# EAGLE design matrix (EAGLE 7.1.0)
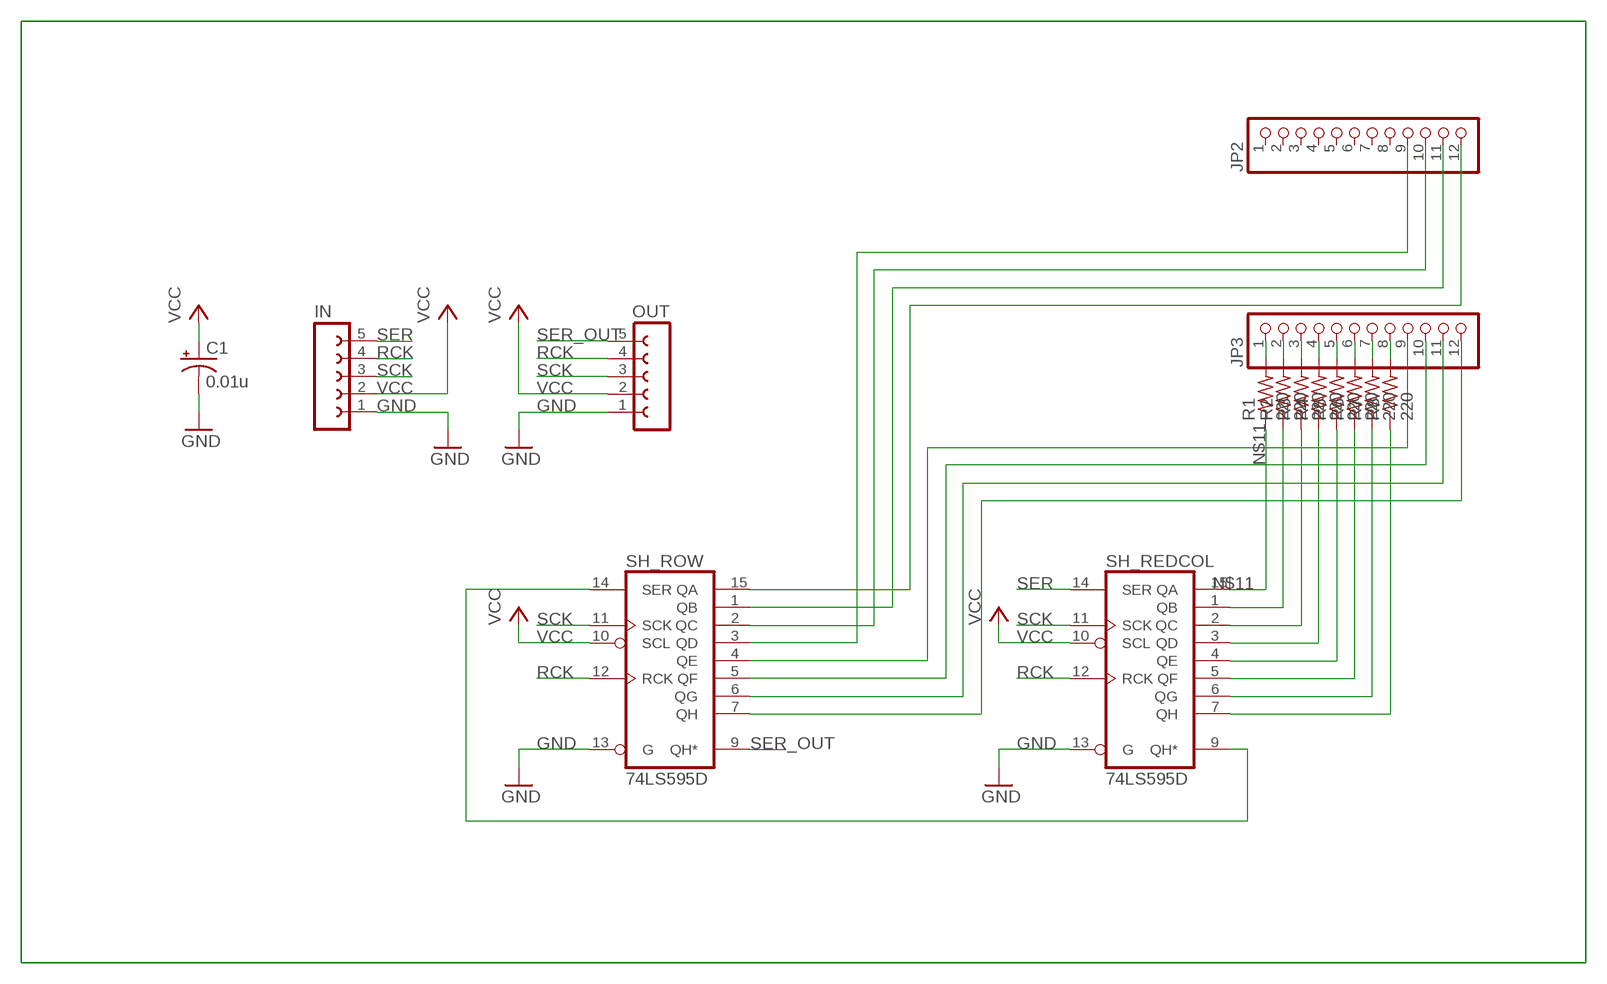
[diagram p0: schematic, sheet 1]

## Parts
C1  0.01u  CPOL-USE2.5-5  [E2,5-5]
IN  FE05W  [FE05W]
JP2  PINHD-1X12-CB  [1X12-CB]
JP3  PINHD-1X12-CB  [1X12-CB]
OUT  FE05W  [FE05W]
R1  220  R-US_R0603  [R0603]
R2  220  R-US_R0603  [R0603]
R3  220  R-US_R0603  [R0603]
R4  220  R-US_R0603  [R0603]
R5  220  R-US_R0603  [R0603]
R6  220  R-US_R0603  [R0603]
R7  220  R-US_R0603  [R0603]
R8  220  R-US_R0603  [R0603]
SH_REDCOL  74LS595D  [SO16]
SH_ROW  74LS595D  [SO16]

## Nets
GND: C1.- IN.1 OUT.1 SH_REDCOL.13(G) SH_ROW.13(G)
N$1: JP3.1 R1.2
N$4: R4.1 SH_REDCOL.3(QD)
N$5: R5.1 SH_REDCOL.4(QE)
N$6: JP2.12 SH_ROW.15(QA)
N$7: JP2.11 SH_ROW.1(QB)
N$8: JP2.10 SH_ROW.2(QC)
N$9: JP2.9 SH_ROW.3(QD)
N$10: JP3.9 SH_ROW.4(QE)
N$11: R1.1 SH_REDCOL.15(QA)
N$12: R2.1 SH_REDCOL.1(QB)
N$13: R3.1 SH_REDCOL.2(QC)
N$14: R6.1 SH_REDCOL.5(QF)
N$15: R7.1 SH_REDCOL.6(QG)
N$16: R8.1 SH_REDCOL.7(QH)
N$17: JP3.10 SH_ROW.5(QF)
N$18: JP3.11 SH_ROW.6(QG)
N$19: JP3.12 SH_ROW.7(QH)
N$22: JP3.2 R2.2
N$23: JP3.3 R3.2
N$24: JP3.4 R4.2
N$25: JP3.5 R5.2
N$26: JP3.6 R6.2
N$27: JP3.7 R7.2
N$28: JP3.8 R8.2
RCK: IN.4 OUT.4 SH_REDCOL.12(RCK) SH_ROW.12(RCK)
SCK: IN.3 OUT.3 SH_REDCOL.11(SCK) SH_ROW.11(SCK)
SER: IN.5 SH_REDCOL.14(SER)
SER2: SH_REDCOL.9(QH*) SH_ROW.14(SER)
SER_OUT: OUT.5 SH_ROW.9(QH*)
VCC: C1.+ IN.2 OUT.2 SH_REDCOL.10(SCL) SH_ROW.10(SCL)
Unconnected: JP2.1 JP2.2 JP2.3 JP2.4 JP2.5 JP2.6 JP2.7 JP2.8

## Power pins joined to a net without a drawn wire
GND: SH_REDCOL.8(GND) SH_ROW.8(GND)
VCC: SH_REDCOL.16(VCC) SH_ROW.16(VCC)

## Library data of the parts
C1 = adafruit:CPOL-US: POLARIZED CAPACITOR, American symbol
IN OUT = con-lsta:FE05W: FEMALE HEADER; OC_FARNELL: unknown; OC_NEWARK: unknown
JP2 JP3 = adafruit:PINHD-1X12: PIN HEADER
R1-R8 = adafruit:R-US_: RESISTOR, American symbol
SH_REDCOL SH_ROW = 74xx-us:74*595: 8-bit SHIFT REGISTER, output latch

## Net classes
0 default: width 0.33 mm

## Board
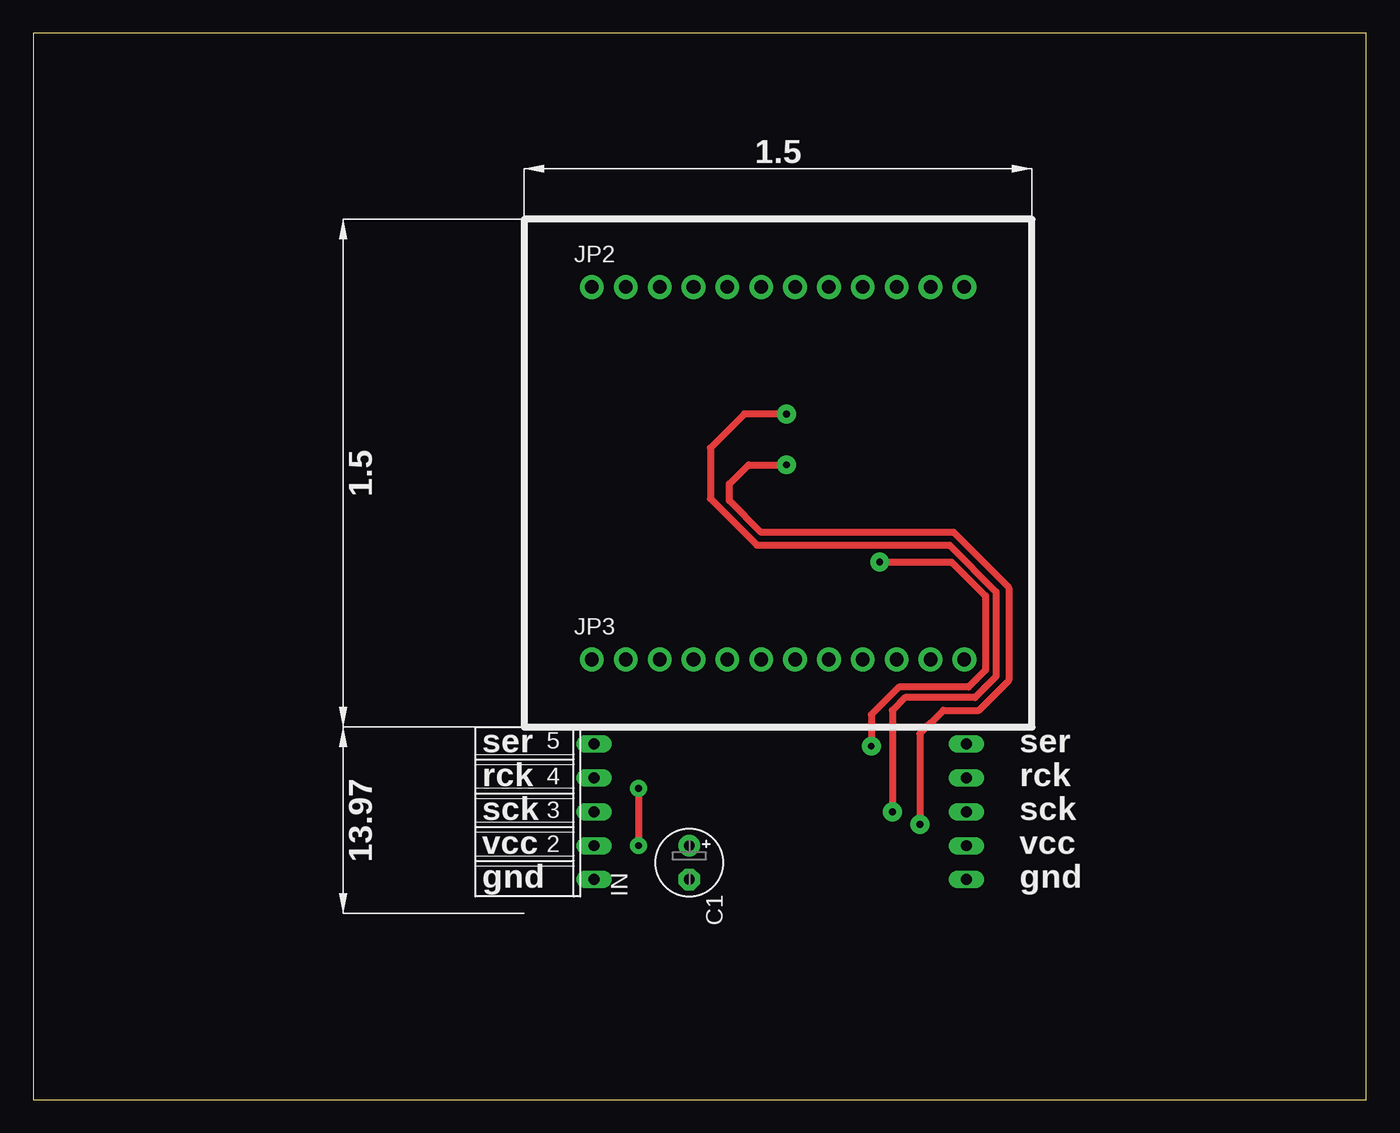
[diagram p1: board, top side]
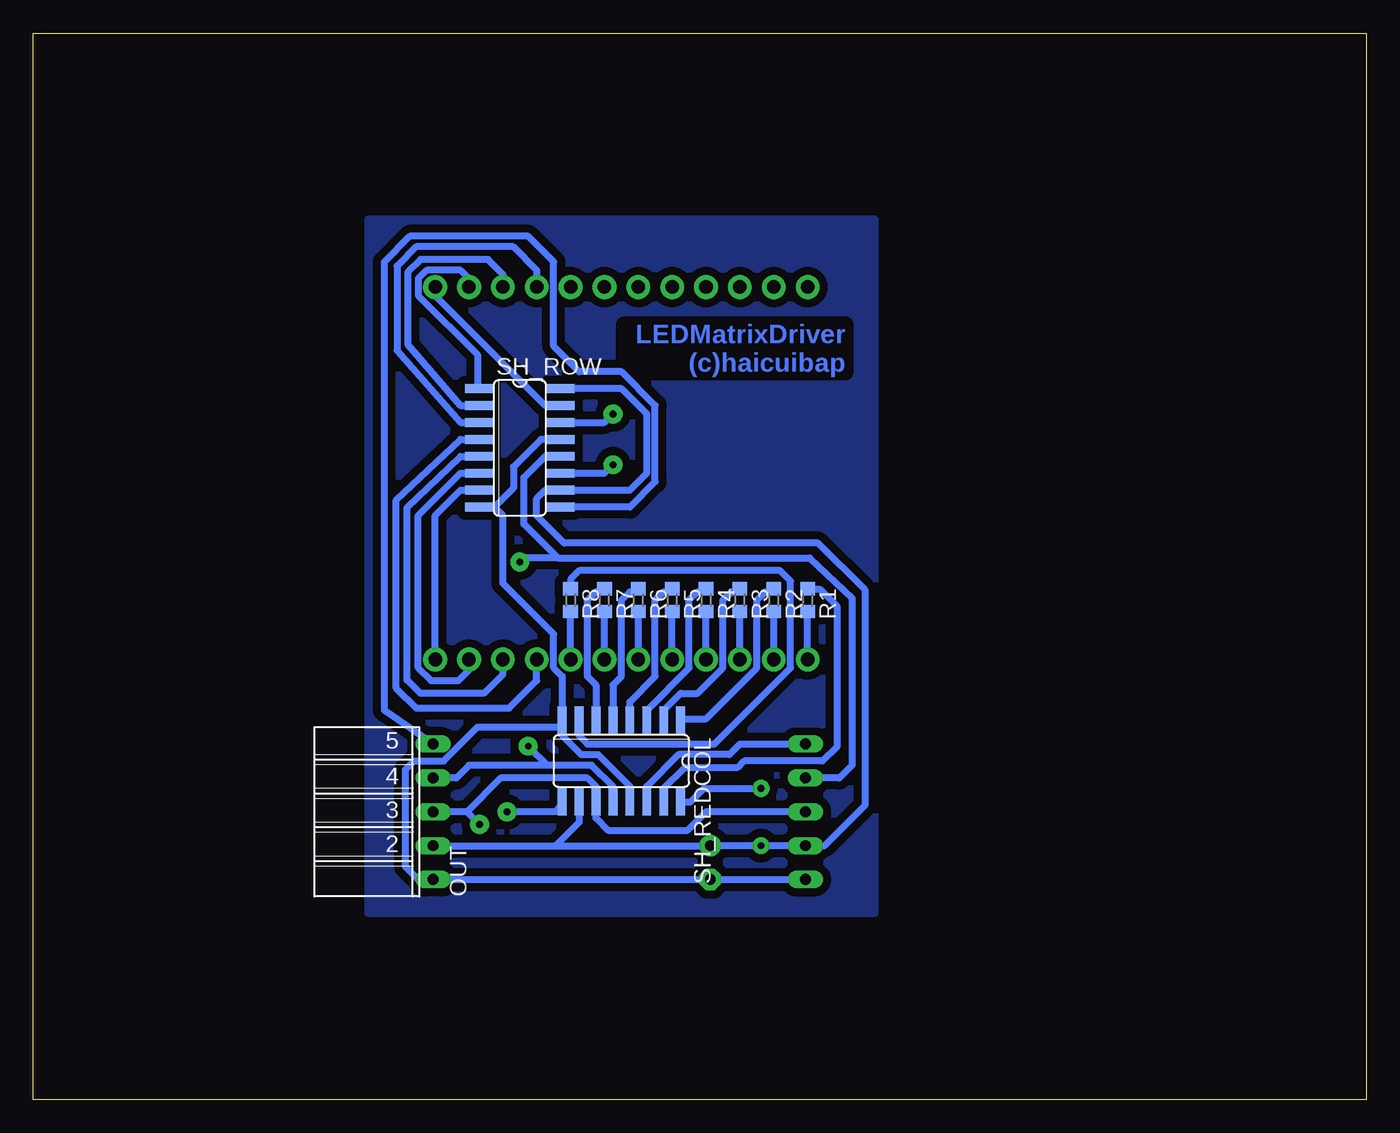
[diagram p2: board, bottom side, seen from below]

Size 100 x 80 mm. Coordinates in mm from the lower left corner, seen from the top.
Outline: 0,0 100,0 100,80 0,80 0,0
Copper layers (1*16): Top 0.035mm / dielectric 1.5mm / Bottom 0.035mm
Design rules "default": minimum track width 10mil, minimum drill 0.6mm, track to track 8mil, track to pad 8mil, pad to pad 8mil, via to via 8mil, smd to smd 8mil, copper to edge 40mil, drill to drill 8mil, minimum pad ring 10mil, minimum via ring 8mil, stop-mask expansion 4mil, vias tented up to drill 0mil, thermal gap 10mil

### Footprints (pad centres in the part's own frame; a part is rotated, then mirrored left to right if it is on the bottom)
E2,5-5 = drill 0.813 pad 1.6: + -1.27,0 | drill 0.813 pad 1.6 octagon: - 1.27,0
FE05W = drill 0.813 long: 1 -5.08,0; 2 -2.54,0; 3 0,0; 4 2.54,0; 5 5.08,0
1X12-CB = drill 1.016 pad 1.778: 1 -13.97,0; 2 -11.43,0; 3 -8.89,0; 4 -6.35,0; 5 -3.81,0; 6 -1.27,0; 7 1.27,0; 8 3.81,0; 9 6.35,0; 10 8.89,0; 11 11.43,0; 12 13.97,0
R0603 = smd 1 x 1.1: 1 -0.85,0; 2 0.85,0
SO16 = smd 0.66 x 2.032: 1 -4.445,-3.073; 2 -3.175,-3.073; 3 -1.905,-3.073; 4 -0.635,-3.073; 5 0.635,-3.073; 6 1.905,-3.073; 7 3.175,-3.073; 8 4.445,-3.073; 9 4.445,3.073; 10 3.175,3.073; 11 1.905,3.073; 12 0.635,3.073; 13 -0.635,3.073; 14 -1.905,3.073; 15 -3.175,3.073; 16 -4.445,3.073

### Placement (x,y rotation side)
C1  49.21,17.78 270 top
IN  42.07,21.59 90 top
JP2  55.88,60.96 0 top
JP3  55.88,33.02 0 top
OUT  70.01,21.59 90 bottom
R1  41.91,37.47 270 bottom
R2  44.45,37.47 270 bottom
R3  46.99,37.47 270 bottom
R4  49.53,37.47 270 bottom
R5  52.07,37.47 270 bottom
R6  54.61,37.47 270 bottom
R7  57.15,37.47 270 bottom
R8  59.69,37.47 270 bottom
SH_REDCOL  55.88,25.4 180 bottom
SH_ROW  63.5,48.9 270 bottom

### Tracks (layer width: path | path; a pad name or v marks a point on that pad's centre or on a via)
GND
  Bottom 0.508: IN.1 C1.- OUT.1 71.12,16.51 72.07,17.46 72.07,24.77 71.44,25.4 69.22,25.4 66.67,27.94 60.33,27.94 | SH_REDCOL.13 55.24,23.5 57.63,25.88 58.9,25.88 60.33,27.3 60.33,27.94 | 60.33,27.94 SH_REDCOL.8 60.33,31.75 60.96,32.38 60.96,34.92 64.77,38.73 64.77,43.81 65.41,44.45 | 65.41,44.45 SH_ROW.8 | SH_ROW.13 61.91,49.53 63.98,47.47 63.98,45.88 65.41,44.45
N$1
  Bottom 0.508: JP3.1 R1.2
N$4
  Bottom 0.508: SH_REDCOL.3 53.98,29.21 50.8,32.38 50.8,37.47 50.16,38.1 49.53,38.1 R4.1
N$5
  Bottom 0.508: SH_REDCOL.4 55.24,29.84 53.34,31.75 53.34,37.47 52.7,38.1 52.07,38.1 R5.1
N$6
  Bottom 0.508: SH_ROW.15 61.59,52.07 69.85,60.33 JP2.12
N$7
  Bottom 0.508: SH_ROW.1 66.67,53.34 66.67,55.88 71.12,60.33 71.12,61.59 70.48,62.23 67.94,62.23 67.31,61.59 JP2.11
N$8
  Bottom 0.508: SH_ROW.2 67.94,52.07 71.91,56.67 71.91,62.07 70.96,63.02 65.88,63.02 64.77,61.91 JP2.10
N$9
  Bottom 0.508: SH_ROW.3 67.94,50.8 72.71,56.2 72.71,62.55 71.28,63.98 63.98,63.98 62.23,62.23 JP2.9
N$10
  Bottom 0.508: SH_ROW.4 67.94,49.53 72.76,44.97 72.76,30.85 71.28,29.37 64.29,29.37 62.23,31.43 JP3.9
N$11
  Bottom 0.508: R1.1 41.85,38.26 40.96,38.26 39.69,36.99 39.69,26.51 40.8,25.4 46.67,25.4 47.15,24.92 51.12,24.92 52.7,23.34 SH_REDCOL.15
N$12
  Bottom 0.508: R2.1 44.45,38.1 45.09,38.1 45.72,37.47 45.72,32.38 49.53,28.57 51.44,28.57 SH_REDCOL.1
N$13
  Bottom 0.508: SH_REDCOL.2 52.7,29.21 51.44,30.48 50.16,30.48 48.26,32.38 48.26,37.47 47.62,38.1 46.99,38.1 R3.1
N$14
  Bottom 0.508: R6.1 54.61,38.1 55.24,38.1 55.88,37.47 55.88,31.75 56.52,31.11 SH_REDCOL.5
N$15
  Bottom 0.508: R7.1 57.15,38.1 57.78,38.1 58.42,37.47 58.42,31.75 57.78,31.11 SH_REDCOL.6
N$16
  Bottom 0.508: SH_REDCOL.7 59.05,27.3 58.42,26.67 48.9,26.67 43.18,32.38 43.18,38.89 43.97,39.69 59.05,39.69 59.69,39.05 R8.1
N$17
  Bottom 0.508: SH_ROW.5 67.94,48.26 71.94,44.43 71.96,43.77 71.96,31.48 70.96,30.48 66.2,30.48 64.77,31.91 JP3.10
N$18
  Bottom 0.508: SH_ROW.6 67.94,46.99 71.12,43.81 71.12,32.38 70.17,31.43 68.1,31.43 67.31,32.23 JP3.11
N$19
  Bottom 0.508: SH_ROW.7 67.94,45.72 69.85,43.81 JP3.12
N$22
  Bottom 0.508: JP3.2 R2.2
N$23
  Bottom 0.508: JP3.3 R3.2
N$24
  Bottom 0.508: JP3.4 R4.2
N$25
  Bottom 0.508: JP3.5 R5.2
N$26
  Bottom 0.508: JP3.6 R6.2
N$27
  Bottom 0.508: JP3.7 R7.2
N$28
  Bottom 0.508: JP3.8 R8.2
N$36
  pour Bottom (isolate 0.61): 74.93,13.97 36.83,13.97 36.83,66.04 74.93,66.04
RCK  (via drill 0.51 pad 1.42)
  Top 0.508: v63.5,40.32 68.9,40.32 71.44,37.78 71.44,32.23 70.17,30.96 64.93,30.96 62.87,28.89 v62.87,26.51
  Bottom 0.508: SH_ROW.12 61.59,48.26 63.18,46.67 63.18,43.18 60.64,40.64 | SH_REDCOL.12 56.52,23.5 58.1,25.08 61.44,25.08 | 60.64,40.64 41.75,40.64 38.58,37.62 38.58,25.08 39.53,24.13 IN.4 | OUT.4 68.26,24.13 67.31,25.08 61.44,25.08 | v62.87,26.51 61.44,25.08 | 60.64,40.64 63.18,40.64 v63.5,40.32
SCK  (via drill 0.51 pad 1.42)
  Top 0.508: v56.52,47.62 53.66,47.62 52.23,46.2 52.23,44.93 54.61,42.55 69.06,42.55 73.18,38.42 73.18,31.43 70.96,29.21 68.26,29.21 66.52,27.46 v66.52,20.64
  Bottom 0.254: 57.78,21.75 SH_REDCOL.11
  Bottom 0.508: SH_REDCOL.11 57.78,23.5 58.42,24.13 64.93,24.13 67.47,21.59 | SH_ROW.11 57.15,46.99 v56.52,47.62 | 69.85,21.59 OUT.3 67.47,21.59 | v66.52,20.64 67.47,21.59 | IN.3 49.53,21.59 50.96,20.16 56.83,20.16 57.78,21.11 57.78,21.75
SER
  Bottom 0.508: IN.5 46.99,26.67 47.78,25.88 51.59,25.88 53.98,23.5 SH_REDCOL.14
SER2  (via drill 0.51 pad 1.42)
  Top 0.508: v56.52,51.44 53.34,51.44 50.8,48.9 50.8,45.09 54.29,41.59 68.74,41.59 72.23,38.1 72.23,31.75 70.64,30.16 65.41,30.16 64.45,29.21 v64.45,21.59
  Bottom 0.508: SH_REDCOL.9 60.33,22.23 60.8,21.59 v64.45,21.59 | SH_ROW.14 57.15,50.8 v56.52,51.44
SER_OUT
  Bottom 0.508: OUT.5 73.66,29.21 73.66,62.87 71.75,64.77 62.87,64.77 60.96,62.87 60.96,56.52 59.05,54.61 55.88,54.61 53.34,52.07 53.34,46.35 55.24,44.45 SH_ROW.9
VCC  (via drill 0.51 pad 1.27)
  Top 0.508: v45.4,23.34 v45.4,19.05
  Bottom 0.508: OUT.2 60.8,19.05 | 59.05,22.23 SH_REDCOL.10 59.05,20.8 60.8,19.05 | SH_ROW.16 55.88,53.34 53.98,51.44 53.98,46.99 55.24,45.72 SH_ROW.10 61.59,45.72 62.23,45.09 62.23,43.81 60.17,41.75 41.12,41.75 37.62,38.26 37.62,22.07 40.64,19.05 IN.2 v45.4,19.05 C1.+ 60.8,19.05 | SH_REDCOL.16 50.7,22.33 49.69,23.34 v45.4,23.34

### Text on the board
Bottom: LEDMatrixDriver / (c)haicuibap
tNames: ser | ser | rck | rck | sck | sck | vcc | vcc | gnd | gnd